# Altium schematic sheet 24V_5V_Buck.SchDoc
size A; SheetNumber: 1; SheetTotal: 1
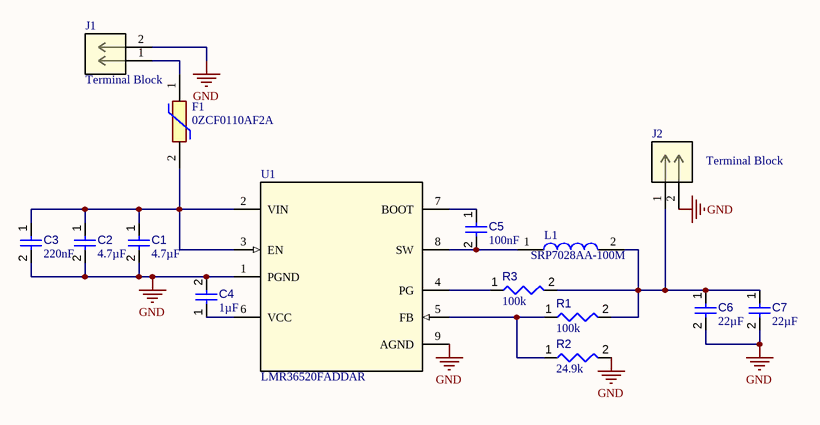
[diagram p0: 24V_5V_Buck.SchDoc]

## Parts
C1  value 4.7µF  [CAPC0603(1608)100_L]  (hidden comment: Capacitor 4.7µF +/-20% 10V 0603)
C2  value 4.7µF  [CAPC0603(1608)100_L]  (hidden comment: Capacitor 4.7µF +/-20% 10V 0603)
C3  value 220nF  [CAPC0402(1005)60_L]  (hidden comment: Capacitor 220nF +/-20% 10V 0402)
C4  value 1µF  [CAPC3216X180X20ML20]  (hidden comment: Capacitor 1 uF +/- 10% 25 V 1206)
C5  value 100nF  [CAPC2013X95X50LL10T25]  (hidden comment: Capacitor 100 nF +/-10% 50 V 0805)
C6  value 22µF  [CAPC0805(2012)145_L]  (hidden comment: Capacitor 22µF +/-40% 16V 0805)
C7  value 22µF  [CAPC0805(2012)145_L]  (hidden comment: Capacitor 22µF +/-40% 16V 0805)
F1  0ZCF0110AF2A  [FUSC7451X170N]
J1  Terminal Block  [CONN2_2710002_WRE]
J2  Terminal Block  [CONN2_2710002_WRE]
L1  SRP7028AA-100M  [INDPM7166X300N]
R1  value 100k  [RESC0402(1005)_L]  (hidden comment: Resistor 100K +/-1 % 0402 63 mW)
R2  value 24.9k  [RESC0402(1005)_L]  (hidden comment: Resistor 100K +/-1 % 0402 63 mW)
R3  value 100k  [RESC0402(1005)_L]  (hidden comment: Resistor 100K +/-1 % 0402 63 mW)
U1  LMR36520FADDAR  [DDA0008J]

## Nets
GND: C1.2 C2.2 C3.2 C4.2 C6.2 C7.2 J1.2 J2.2 R2.2 U1.1(PGND) U1.9(AGND)
NetC1_1: C1.1 C2.1 C3.1 F1.2 U1.2(VIN) U1.3(EN)
NetC4_1: C4.1 U1.6(VCC)
NetC5_1: C5.1 U1.7(BOOT)
NetC5_2: C5.2 L1.1 U1.8(SW)
NetC6_1: C6.1 C7.1 J2.1 L1.2 R1.2 R3.2
NetF1_1: F1.1 J1.1
NetR1_1: R1.1 R2.1 U1.5(FB)
NetR3_1: R3.1 U1.4(PG)

## Library data of the parts
C1 C2 = CMP-001-00076-4: Chip Capacitor, 4.7µF +/-20%, 10V, 0603, Thickness 1 mm; Tolerance: 10%; Mounting Technology: SMT; Case/Package: 0603; Pins: 2; Min Operating Temperature: -55°C; Max Operating Temperature: 85°C; Voltage Rating: 10V
C3 = CMP-001-00057-3: Chip Capacitor, 220nF +/-20%, 10V, 0402, Thickness 0.6 mm; Tolerance: 10%; Max Operating Temperature: 85°C; Pins: 2; Case/Package: 0402; Mounting Technology: SMT; Voltage Rating: 10V; Min Operating Temperature: -55°C
C4 = CMP-001-00006-6: Chip Capacitor, 1 uF, +/- 10%, 25 V, 1206 (3216 Metric); Capacitor Type: Ceramic; Voltage Rating: 25V; Tolerance: 10%; Min Operating Temperature: -55°C; Pins: 2; Case/Package: 1206; Max Operating Temperature: 125°C; Mounting Technology: SM; RoHS Compliant: True
C5 = CMP-001-00018-6: Chip Capacitor, 100 nF, +/- 10%, 50 V, 0805 (2012 Metric); Capacitor Type: Ceramic; Voltage Rating: 50V; Pins: 2; Max Operating Temperature: 125°C; Min Operating Temperature: -55°C; Mounting Technology: SM; Case/Package: 0805; RoHS Compliant: True; Tolerance: 10%
C6 C7 = CMP-001-00081-4: Chip Capacitor, 22µF +/-40%, 16V, 0805, Thickness 1.45 mm; Tolerance: 5%; Voltage Rating: 16V; Mounting Technology: SMT; Pins: 2; Max Operating Temperature: 85°C; Case/Package: 0805; Min Operating Temperature: -55°C
F1 = 0ZCF0110AF2A: Resettable Fuse; Manufacturer_Name: Bel Circuit Protection; Datasheet Link: https://belfuse.com/resources/datasheets/circuitprotection/ds-cp-0zcf-series.pdf; Height: 1.7mm; Manufacturer_Part_Number: 0ZCF0110AF2A; Arrow Part Number: 0ZCF0110AF2A; Arrow Price/Stock: https://www.arrow.com/en/products/0zcf0110af2a/bel-group?utm_currency=USD&region=europe
J1 J2 = 691102710002: WR-TBL Terminal block - Wire protector - THT; Manufacturer_Name: Wurth Electronics; Type: Wire to Board; Copyright: Copyright (C) 2026 Ultra Librarian. All rights reserved.; Manufacturer_Part_Number: 691102710002; RefDes: RefDes
L1 = SRP7028AA-100M: Inductor; Manufacturer_Name: Bourns; Datasheet Link: https://www.bourns.com/docs/Product-Datasheets/SRP7028AA.pdf; Height: 3mm; Manufacturer_Part_Number: SRP7028AA-100M; Mouser Part Number: 652-SRP7028AA-100M; Mouser Price/Stock: https://www.mouser.co.uk/ProductDetail/Bourns/SRP7028AA-100M?qs=CiayqK2gdcLCkUvULW7S2A%3D%3D; Arrow Part Number: SRP7028AA-100M; Arrow Price/Stock: https://www.arrow.com/en/products/srp7028aa-100m/bourns.html?utm_currency=USD&region=nac
R1 R3 = CMP-009-00168-3: Chip Resistor, 100 kOhms, +/-1 %, 63 mW, -55 to 155 degC, 0402; Tolerance: 1%; Power: 63mW; Max Operating Temperature: 155°C; Min Operating Temperature: -55°C; Pins: 2; Case/Package: 0402
R2 = CMP-009-00171-3: Chip Resistor, 24,9 kOhms, +/-1 %, 63 mW, -55 to 155 degC, 0402; Tolerance: 1%; Power: 63mW; Case/Package: 0402; Min Operating Temperature: -55°C; Max Operating Temperature: 155°C; Pins: 2
U1 = LMR36520FADDAR: SIMPLE SWITCHER&reg; 4.2-V to 65-V, 2-A synchronous step-down converter with 26-uA IQ 8-SO PowerPAD -40 to 125; Manufacturer_Name: Texas Instruments; TYPE: TYPE; RefDes: RefDes; Copyright: Copyright (C) 2025 Ultra Librarian. All rights reserved.; Manufacturer_Part_Number: LMR36520FADDAR